# EAGLE design profboard (EAGLE 8.6.0)
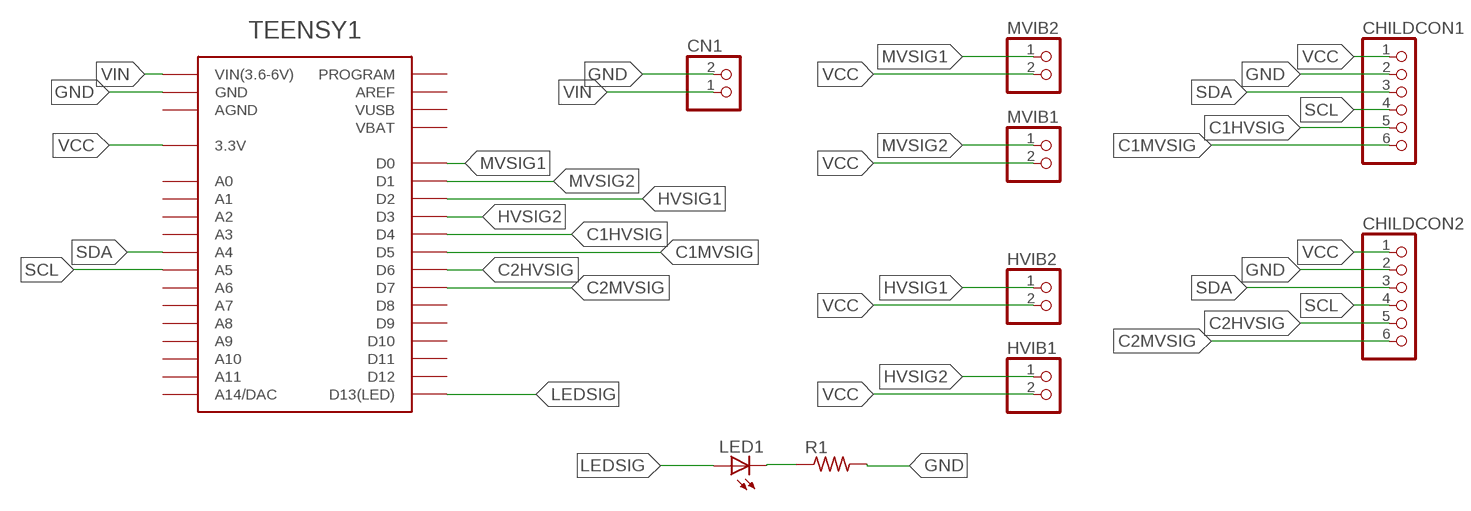
[diagram p0: schematic, sheet 1]

## Parts
CHILDCON1  PINHD-1X6  [1X06]
CHILDCON2  PINHD-1X6  [1X06]
CN1  JST_2PIN-THM-RA  [JST-PH-2-THM-RA]
HVIB1  PINHD-1X2  [1X02]
HVIB2  PINHD-1X2  [1X02]
LED1  LED5MM  [LED5MM]
MVIB1  PINHD-1X2  [1X02]
MVIB2  PINHD-1X2  [1X02]
R1  R-US_0204/7  [0204/7]
TEENSY1  TEENSY3.2  [TEENSY3.2]

## Nets
C1HVSIG: CHILDCON1.5 TEENSY1.4(D4)
C1MVSIG: CHILDCON1.6 TEENSY1.5(D5)
C2HVSIG: CHILDCON2.5 TEENSY1.6(D6)
C2MVSIG: CHILDCON2.6 TEENSY1.7(D7)
GND: CHILDCON1.2 CHILDCON2.2 CN1.2 R1.2 TEENSY1.G(GND) TEENSY1.GND
HVSIG1: HVIB2.1 TEENSY1.2(D2)
HVSIG2: HVIB1.1 TEENSY1.3(D3)
LEDSIG: LED1.A TEENSY1.13(D13(LED))
MVSIG1: MVIB2.1 TEENSY1.0(D0)
MVSIG2: MVIB1.1 TEENSY1.1(D1)
N$1: LED1.K(C) R1.1
SCL: CHILDCON1.4 CHILDCON2.4 TEENSY1.19(A5)
SDA: CHILDCON1.3 CHILDCON2.3 TEENSY1.18(A4)
VCC: CHILDCON1.1 CHILDCON2.1 HVIB1.2 HVIB2.2 MVIB1.2 MVIB2.2 TEENSY1.3V(3.3V) TEENSY1.V(3.3V)
VIN: CN1.1 TEENSY1.VIN(VIN(3.6-6V))
Unconnected: TEENSY1.8(D8) TEENSY1.9(D9) TEENSY1.10(D10) TEENSY1.11(D11) TEENSY1.12(D12) TEENSY1.14(A0) TEENSY1.15(A1) TEENSY1.16(A2) TEENSY1.17(A3) TEENSY1.20(A6) TEENSY1.21(A7) TEENSY1.22(A8) TEENSY1.23(A9) TEENSY1.A10 TEENSY1.A11 TEENSY1.AGND TEENSY1.AREF TEENSY1.BAT(VBAT) TEENSY1.D(A14/DAC) TEENSY1.P(PROGRAM) TEENSY1.VUSB

## Library data of the parts
CHILDCON1 CHILDCON2 = pinhead:PINHD-1X6: PIN HEADER
CN1 = adafruit:JST_2PIN: JST 2-Pin Connectors of various flavors SMT-RA (S2B-PH-SM4) 4UConnector #17311 SMT (B2B-PH-SM4) THM-RA (S2B-PH) THM (B2B-PH)
HVIB1 HVIB2 MVIB1 MVIB2 = pinhead:PINHD-1X2: PIN HEADER
LED1 = adafruit:LED: LED OSRAM: - CHIPLED LG R971, LG N971, LY N971, LG Q971, LY Q971, LO R971, LY R971 LH N974, LH R974 LS Q976, LO Q976, LY Q976 LO Q996 - Hyper CHIPLED LW Q18S LB Q993, LB Q99A, LB R99A - SideLED LS A670, LO A670, LY A670, LG A670, LP A670 LB A673, LV A673, LT A673, LW A673 LH A674 LY A675 LS A676, LA A676, LO A676, LY A676, LW A676 LS A679, LY A679, LG A679 - Hyper Micro SIDELED® LS Y876, LA Y876, LO Y876, LY Y876 LT Y87S - SmartLED LW L88C, LW L88S LB L89C, LB L89S, LG L890 LS L89K, LO L89K, LY L89K LS L896, LA L896, LO L896, LY L896 - TOPLED LS T670, LO T670, LY T670, LG T670, LP T670 LSG T670, LSP T670, LSY T670, LOP T670, LYG T670 LG T671, LOG T671, LSG T671 LB T673, LV T673, LT T673, LW T673 LH T674 LS T676, LA T676, LO T676, LY T676, LB T676, LH T676, LSB T676, LW T676 LB T67C, LV T67C, LT T67C, LS T67K, LO T67K, LY T67K, LW E67C LS E67B, LA E67B, LO E67B, LY E67B, LB E67C, LV E67C, LT E67C LW T67C LS T679, LY T679, LG T679 LS T770, LO T770, LY T770, LG T770, LP T770 LB T773, LV T773, LT T773, LW T773 LH T774 LS E675, LA E675, LY E675, LS T675 LS T776, LA T776, LO T776, LY T776, LB T776 LHGB T686 LT T68C, LB T68C - Hyper Mini TOPLED® LB M676 - Mini TOPLED Santana® LG M470 LS M47K, LO M47K, LY M47K Source: http://www.osram.convergy.de/
R1 = adafruit:R-US_: RESISTOR, American symbol
TEENSY1 = Teensy3_2:TEENSY3.2

## Net classes
0 default: width 0.813 mm, drill 0.813 mm, clearance 0.813 mm

## Board
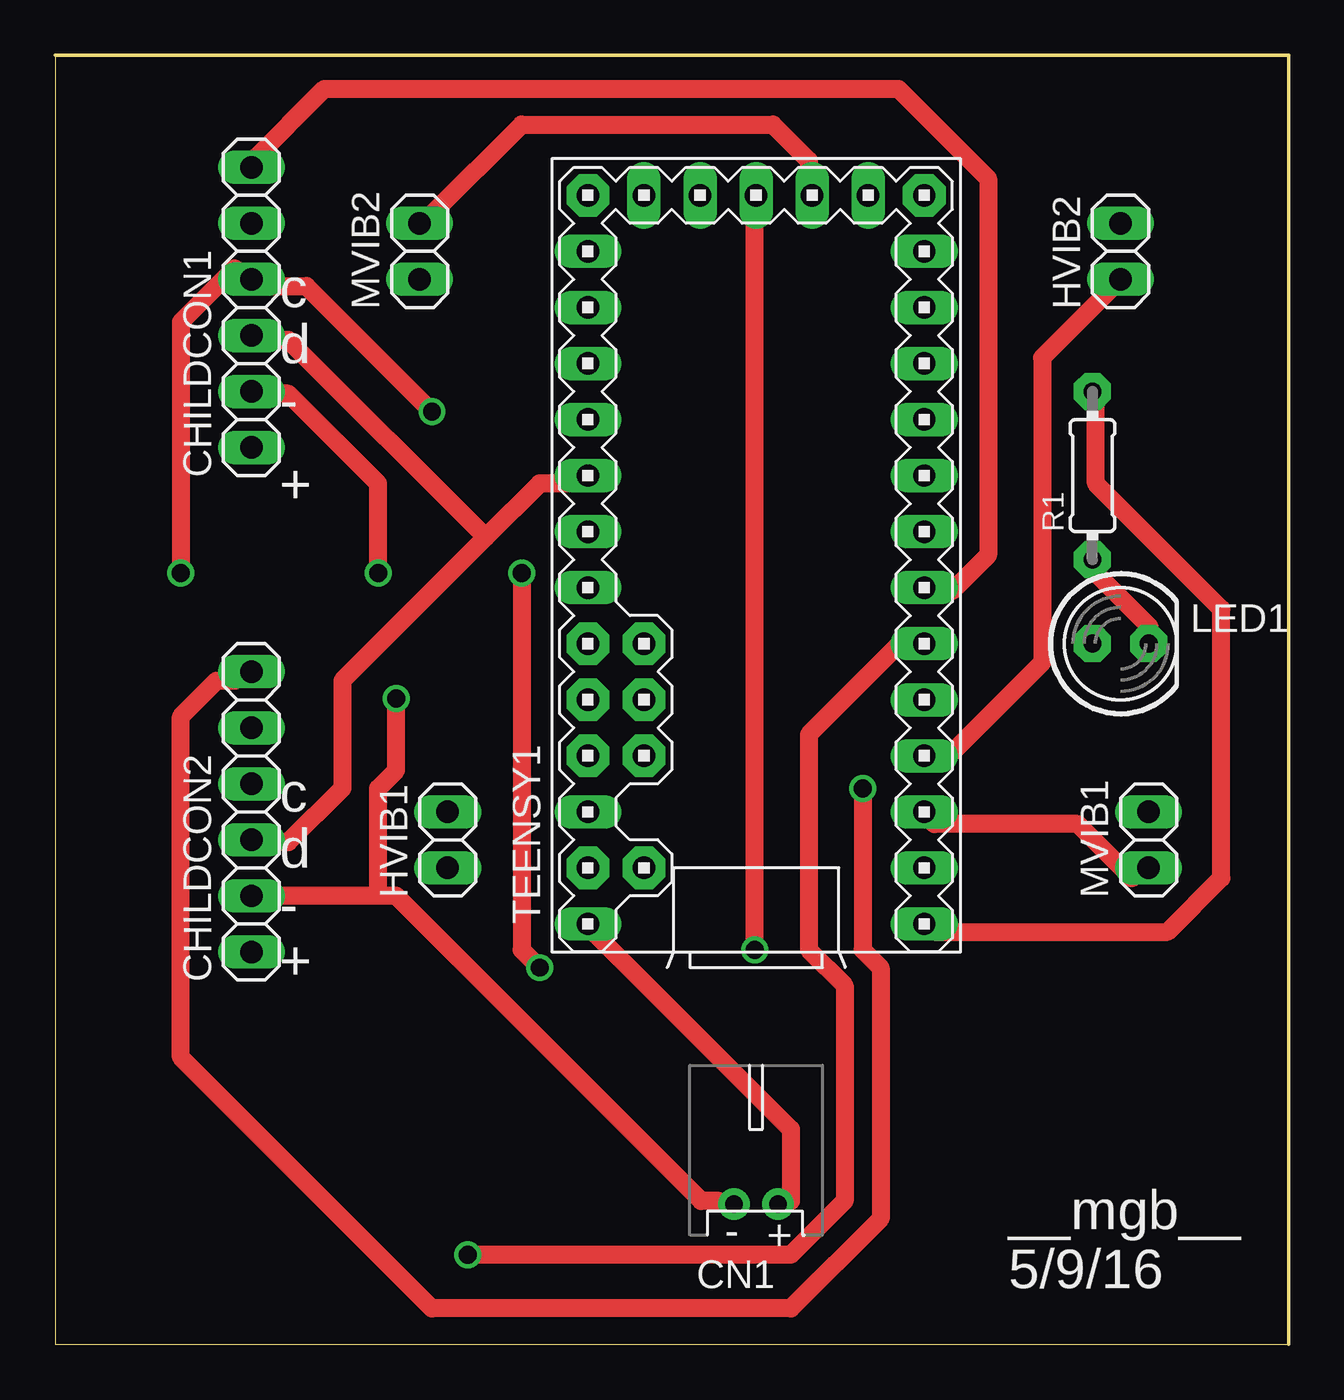
[diagram p1: board, top side]
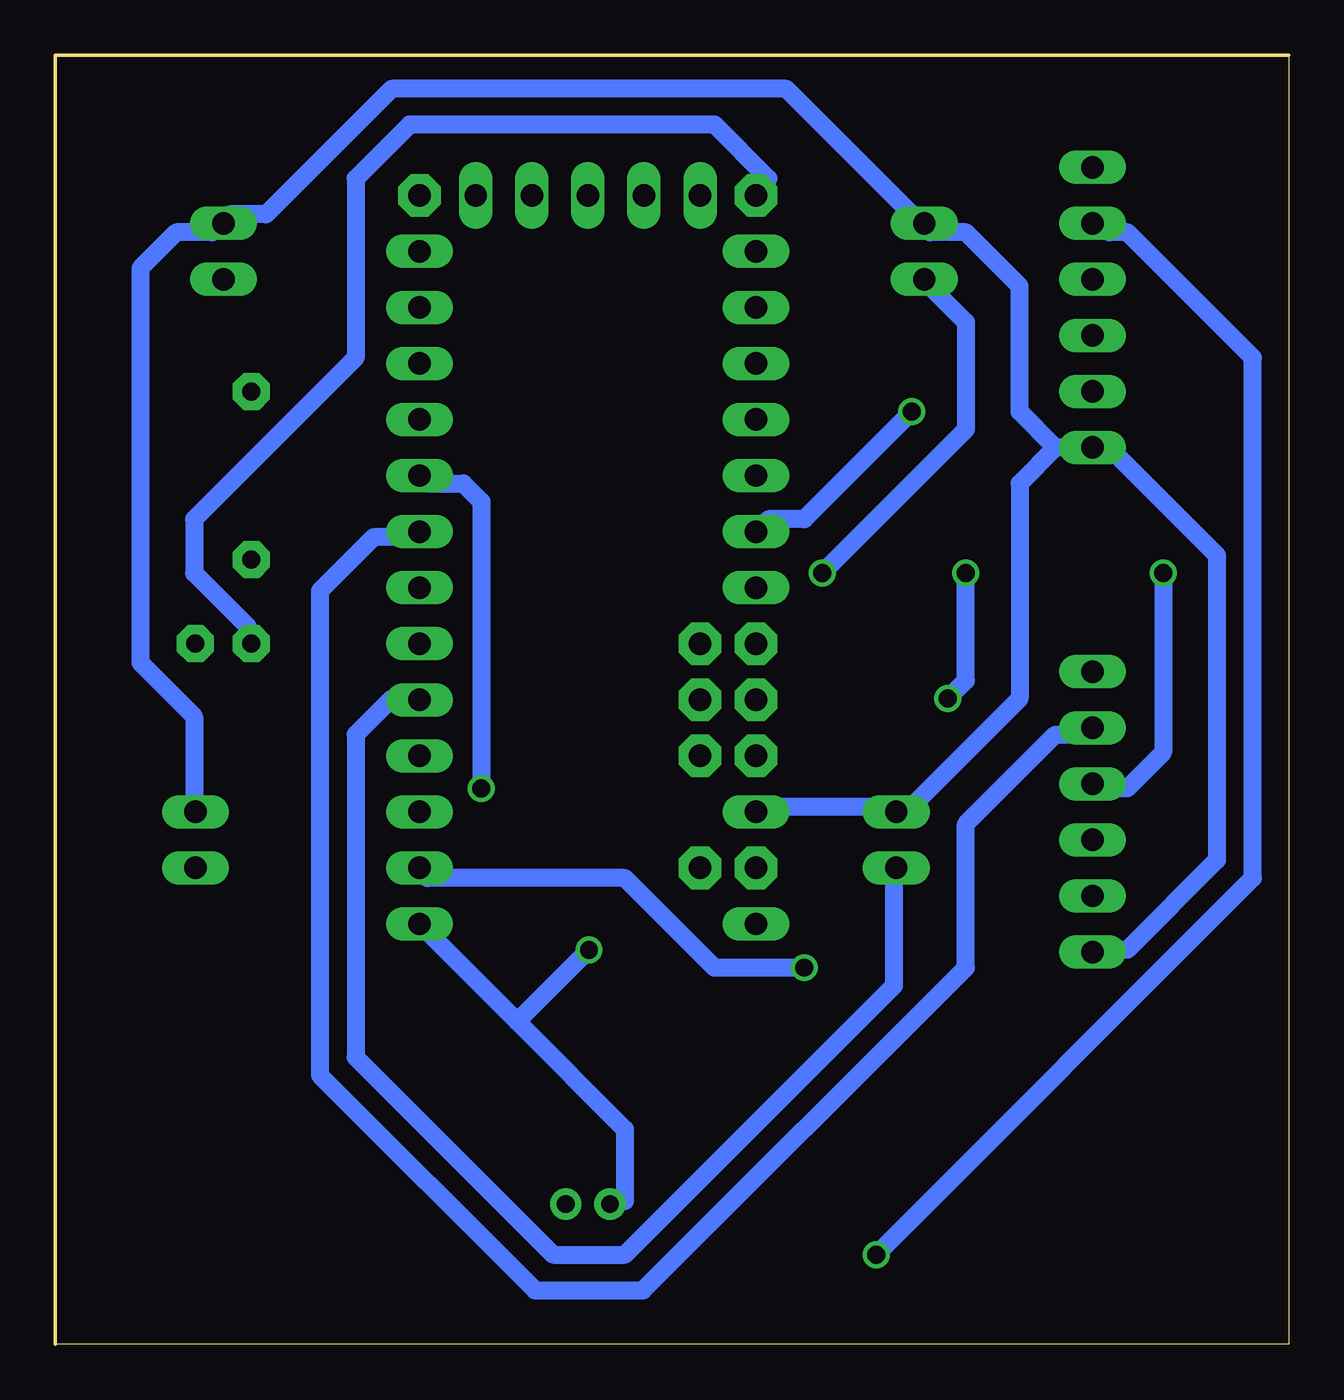
[diagram p2: board, bottom side, seen from below]

Size 55.88 x 58.42 mm. Coordinates in mm from the lower left corner, seen from the top.
Outline: 0,0 55.88,0 55.88,58.42 0,58.42 0,0
Copper layers (1*16): Top 0.035mm / dielectric 1.5mm / Bottom 0.035mm
Design rules "default": minimum track width 6mil, minimum drill 0.35mm, track to track 6mil, track to pad 6mil, pad to pad 6mil, via to via 6mil, smd to smd 6mil, copper to edge 40mil, drill to drill 6mil, minimum pad ring 10mil, minimum via ring 8mil, stop-mask expansion 4mil, vias tented up to drill 0mil, thermal gap 10mil

### Footprints (pad centres in the part's own frame; a part is rotated, then mirrored left to right if it is on the bottom)
1X06 = drill 1.016 long: 1 -6.35,0; 2 -3.81,0; 3 -1.27,0; 4 1.27,0; 5 3.81,0; 6 6.35,0
JST-PH-2-THM-RA = drill 0.8 pad 1.422: 1 1,0; 2 -1,0
1X02 = drill 1.016 long: 1 -1.27,0; 2 1.27,0
LED5MM = drill 0.813 pad 1.676 octagon: A -1.27,0; K 1.27,0
0204/7 = drill 0.813 pad 1.676 octagon: 1 -3.81,0; 2 3.81,0
TEENSY3.2 = drill 1.016 pad 1.524 long: 0 7.62,-13.97; 1 7.62,-11.43; 2 7.62,-8.89; 3 7.62,-6.35; 3V -7.62,-11.43; 4 7.62,-3.81; 5 7.62,-1.27; 6 7.62,1.27; 7 7.62,3.81; 8 7.62,6.35; 9 7.62,8.89; 10 7.62,11.43; 11 7.62,13.97; 14 -7.62,13.97; 15 -7.62,11.43; 16 -7.62,8.89; 17 -7.62,6.35; 18 -7.62,3.81; 19 -7.62,1.27; 20 -7.62,-1.27; BAT 5.08,16.51; D -5.08,16.51; G 0,16.51; GND 7.62,-16.51; P -2.54,16.51; V 2.54,16.51; VIN -7.62,-16.51 | drill 1.016 pad 1.93 octagon: 12 7.62,16.51; 13 -7.62,16.51; 21 -7.62,-3.81; 22 -7.62,-6.35; 23 -7.62,-8.89; A10 -5.08,-6.35; A11 -5.08,-3.81; AGND -7.62,-13.97; AREF -5.08,-8.89; VUSB -5.08,-13.97

### Placement (x,y rotation side)
CHILDCON1  8.89,46.99 90 top
CHILDCON2  8.89,24.13 90 top
CN1  31.75,6.35 0 top
HVIB1  17.78,22.86 90 top
HVIB2  48.26,49.53 90 top
LED1  48.26,31.75 0 top
MVIB1  49.53,22.86 90 top
MVIB2  16.51,49.53 90 top
R1  46.99,39.37 90 top
TEENSY1  31.75,35.56 0 top

### Tracks (layer width: path | path; a pad name or v marks a point on that pad's centre or on a via)
C1HVSIG  (via drill 0.81)
  Top 0.813: v18.69,4.06 33.33,4.06 35.76,6.5 35.76,16.26 34.14,17.88 34.14,27.64 38.2,31.7 39.01,31.7 TEENSY1.4
  Bottom 0.813: v18.69,4.06 1.63,21.13 1.63,44.7 7.32,50.39 8.13,50.39 CHILDCON1.5
C1MVSIG
  Top 0.813: TEENSY1.5 39.83,34.14 40.64,34.14 42.27,35.76 42.27,52.83 38.2,56.9 12.19,56.9 8.94,53.65 CHILDCON1.6
C2HVSIG
  Bottom 0.813: CHILDCON2.5 8.94,27.64 10.57,27.64 14.63,23.57 14.63,17.07 29.26,2.44 34.14,2.44 43.89,12.19 43.89,34.14 41.45,36.58 39.83,36.58 TEENSY1.6
C2MVSIG  (via drill 0.81)
  Top 0.813: v36.58,25.2 36.58,17.88 37.39,17.07 37.39,5.69 33.33,1.63 17.07,1.63 5.69,13.01 5.69,28.45 7.32,30.07 8.13,30.07 CHILDCON2.6
  Bottom 0.813: v36.58,25.2 36.58,38.2 37.39,39.01 39.01,39.01 TEENSY1.7
GND  (via drill 0.81)
  Top 0.813: 14.63,20.32 15.44,20.32 29.26,6.5 30.07,6.5 CN1.2 | 14.63,20.32 CHILDCON2.2 | v14.63,34.95 14.63,39.01 10.57,43.08 8.94,43.08 CHILDCON1.2 | v15.44,29.26 15.44,26.01 14.63,25.2 14.63,20.32 | v31.7,17.88 31.7,52.02 TEENSY1.G | R1.2 47.14,43.08 47.14,39.01 52.83,33.33 52.83,21.13 50.39,18.69 39.83,18.69 TEENSY1.GND
  Bottom 0.813: TEENSY1.GND 34.95,14.63 | 34.95,14.63 30.07,9.75 30.07,6.5 CN1.2 | v14.63,34.95 14.63,30.07 v15.44,29.26 | 34.95,14.63 v31.7,17.88
HVSIG1
  Top 0.813: HVIB2.1 44.7,44.7 44.7,30.89 40.64,26.82 39.83,26.82 TEENSY1.2
HVSIG2
  Bottom 0.813: HVIB1.1 17.88,21.13 17.88,16.26 30.07,4.06 33.33,4.06 42.27,13.01 42.27,27.64 40.64,29.26 39.83,29.26 TEENSY1.3
LEDSIG
  Bottom 0.813: LED1.A 47.14,32.51 49.58,34.95 49.58,37.39 42.27,44.7 42.27,52.83 39.83,55.27 26.01,55.27 23.57,52.83 TEENSY1.13
MVSIG1  (via drill 0.81)
  Top 0.813: v21.95,17.07 21.13,17.88 v21.13,34.95
  Bottom 0.813: v21.95,17.07 26.01,17.07 30.07,21.13 39.01,21.13 TEENSY1.0 | v21.13,34.95 14.63,41.45 14.63,46.33 16.26,47.95 MVIB2.1
MVSIG2
  Top 0.813: TEENSY1.1 39.83,23.57 46.33,23.57 48.77,21.13 MVIB1.1
N$1
  Top 0.813: R1.1 47.14,34.95 49.58,32.51 LED1.K
SCL  (via drill 0.81)
  Top 0.813: v5.69,34.95 5.69,46.33 8.13,48.77 CHILDCON1.4 8.94,47.95 11.38,47.95 v17.07,42.27
  Bottom 0.813: v5.69,34.95 5.69,26.82 7.32,25.2 8.13,25.2 CHILDCON2.4 | v17.07,42.27 21.95,37.39 23.57,37.39 TEENSY1.19
SDA
  Top 0.813: 19.51,36.58 21.95,39.01 23.57,39.01 TEENSY1.18 | 19.51,36.58 13.01,30.07 13.01,25.2 10.57,22.76 8.94,22.76 CHILDCON2.3 | 19.51,36.58 10.57,45.52 8.94,45.52 CHILDCON1.3
VCC
  Top 0.813: TEENSY1.V 34.14,52.83 34.14,53.65 32.51,55.27 21.13,55.27 17.07,51.21 MVIB2.2
  Bottom 0.813: MVIB1.2 49.58,24.38 49.58,28.45 52.02,30.89 52.02,48.77 50.39,50.39 48.77,50.39 HVIB2.2 47.95,51.21 46.33,51.21 40.64,56.9 22.76,56.9 17.07,51.21 MVIB2.2 16.26,50.39 14.63,50.39 12.19,47.95 12.19,42.27 10.57,40.64 | TEENSY1.3V 23.57,24.38 17.88,24.38 HVIB1.2 17.07,24.38 12.19,29.26 12.19,39.01 10.57,40.64 | CHILDCON2.1 8.13,17.88 7.32,17.88 3.25,21.95 3.25,35.76 8.13,40.64 CHILDCON1.1 10.57,40.64
VIN
  Top 0.813: CN1.1 33.33,6.5 33.33,9.75 24.38,18.69 TEENSY1.VIN

### Text on the board
tNames: c | d | - | + | c | d | - | + | __mgb__ / 5/9/16